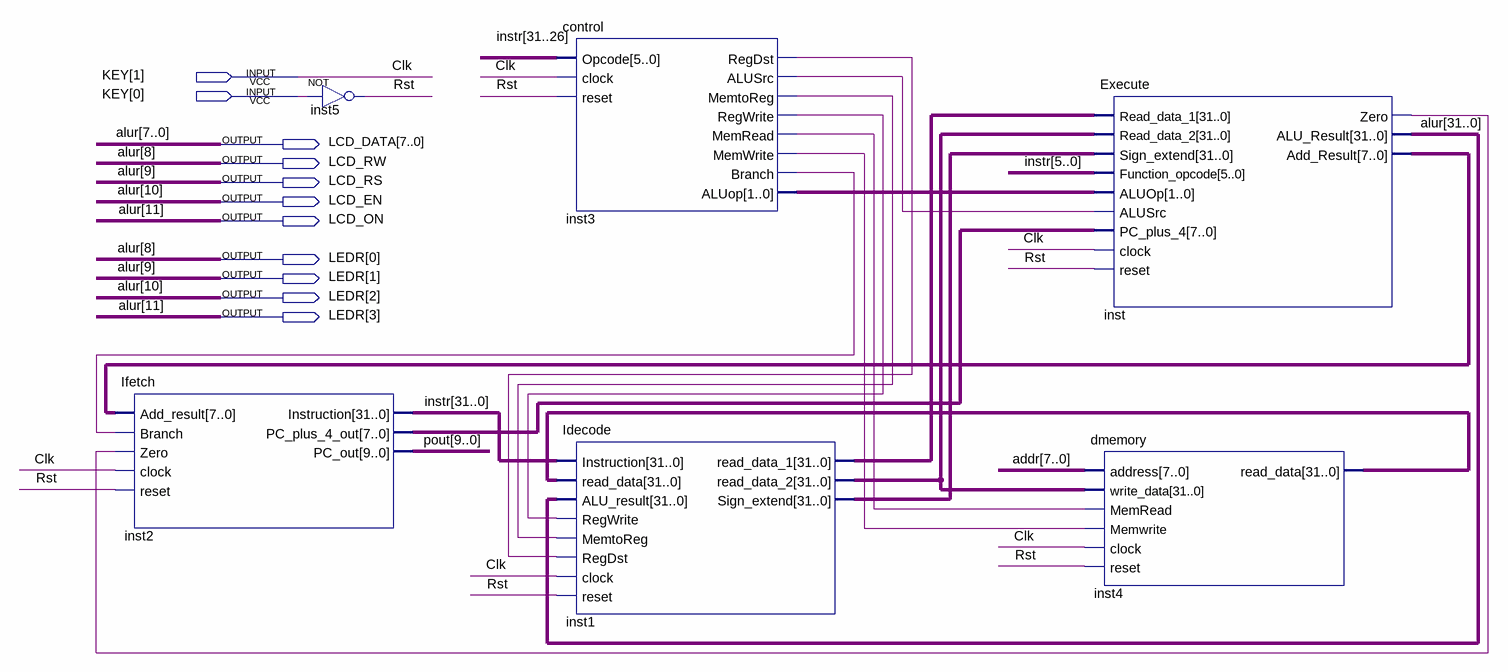
[diagram p0: schematic sheet]
// Quartus schematic mips.bdf as structural Verilog: 6 symbols, 11 pins
module mips (
  input  [1:0] KEY,
  output [7:0] LCD_DATA,
  output LCD_RW,
  output LCD_RS,
  output LCD_EN,
  output LCD_ON,
  output [3:0] LEDR
);

  wire inst3_alusrc, inst3_branch, inst3_memread, inst3_memtoreg, inst3_memwrite, inst3_regdst,
       inst3_regwrite, inst_zero, Rst;
  wire [1:0] inst3_aluop;
  wire [7:0] addr, inst2_pc_plus_4_out, inst_add_result;
  wire [9:0] pout;
  wire [31:0] inst1_read_data_1, inst1_read_data_2, inst1_sign_extend, inst4_read_data, instr;
  wire [31:12] alur;

  Ifetch inst2 (
    .Add_result(inst_add_result), .Branch(inst3_branch), .Zero(inst_zero), .clock(KEY[1]), .reset(Rst),
    .Instruction(instr), .PC_plus_4_out(inst2_pc_plus_4_out), .PC_out(pout));
  not inst5 (Rst, KEY[0]);
  control inst3 (
    .Opcode(instr[31:26]), .clock(KEY[1]), .reset(Rst), .RegDst(inst3_regdst), .ALUSrc(inst3_alusrc),
    .MemtoReg(inst3_memtoreg), .RegWrite(inst3_regwrite), .MemRead(inst3_memread), .MemWrite(inst3_memwrite),
    .Branch(inst3_branch), .ALUop(inst3_aluop));
  Idecode inst1 (
    .Instruction(instr), .read_data(inst4_read_data),
    .ALU_result({alur, LCD_ON, LCD_EN, LCD_RS, LCD_RW, LCD_DATA}), .RegWrite(inst3_regwrite),
    .MemtoReg(inst3_memtoreg), .RegDst(inst3_regdst), .clock(KEY[1]), .reset(Rst),
    .read_data_1(inst1_read_data_1), .read_data_2(inst1_read_data_2), .Sign_extend(inst1_sign_extend));
  Execute inst (
    .Read_data_1(inst1_read_data_1), .Read_data_2(inst1_read_data_2), .Sign_extend(inst1_sign_extend),
    .Function_opcode(instr[5:0]), .ALUOp(inst3_aluop), .ALUSrc(inst3_alusrc),
    .PC_plus_4(inst2_pc_plus_4_out), .clock(KEY[1]), .reset(Rst), .Zero(inst_zero),
    .ALU_Result({alur, LCD_ON, LCD_EN, LCD_RS, LCD_RW, LCD_DATA}), .Add_Result(inst_add_result));
  dmemory inst4 (
    .address(addr), .write_data(inst1_read_data_2), .MemRead(inst3_memread), .Memwrite(inst3_memwrite),
    .clock(KEY[1]), .reset(Rst), .read_data(inst4_read_data));

  assign LEDR = {LCD_ON, LCD_EN, LCD_RS, LCD_RW};

  // Other names for the same wires on the sheet: alur[11:0] = {LCD_ON, LCD_EN, LCD_RS, LCD_RW, LCD_DATA};
  //   Clk = KEY[1]
endmodule
